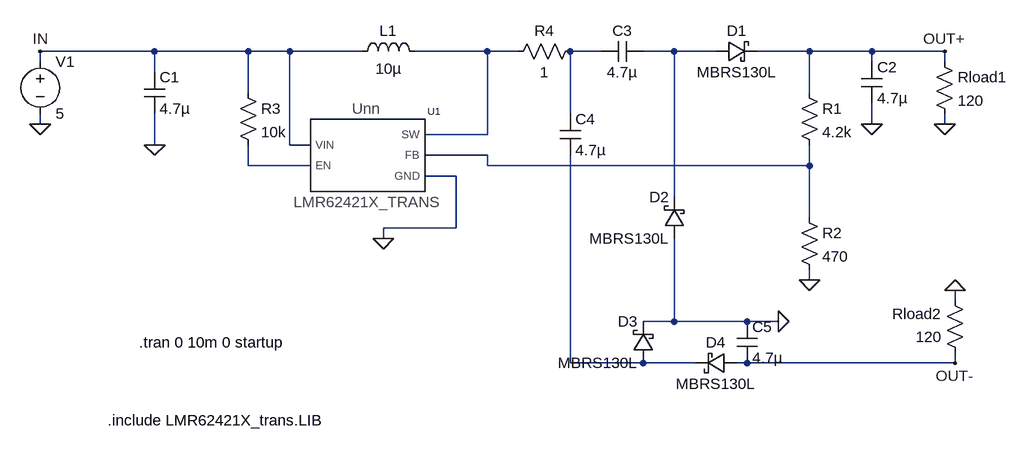
[diagram p0: schematic TI_LMR62421X_dual.asc]
TI_LMR62421X_dual.asc, the LTspice schematic file:
Version 4
SHEET 1 1960 1064
WIRE 240 480 64 480
WIRE 384 480 240 480
WIRE 448 480 384 480
WIRE 560 480 448 480
WIRE 752 480 640 480
WIRE 800 480 752 480
WIRE 928 480 880 480
WIRE 1040 480 992 480
WIRE 1104 480 1040 480
WIRE 1248 480 1168 480
WIRE 1344 480 1248 480
WIRE 1456 480 1344 480
WIRE 64 496 64 480
WIRE 1344 496 1344 480
WIRE 1456 496 1456 480
WIRE 240 512 240 480
WIRE 384 544 384 480
WIRE 1248 544 1248 480
WIRE 880 576 880 480
WIRE 64 592 64 576
WIRE 1344 592 1344 560
WIRE 1456 592 1456 576
WIRE 752 608 752 480
WIRE 752 608 656 608
WIRE 240 624 240 576
WIRE 448 624 448 480
WIRE 480 624 448 624
WIRE 752 640 656 640
WIRE 384 656 384 624
WIRE 480 656 384 656
WIRE 752 656 752 640
WIRE 1248 656 1248 624
WIRE 1248 656 752 656
WIRE 704 672 656 672
WIRE 1040 704 1040 480
WIRE 1248 736 1248 656
WIRE 704 752 704 672
WIRE 704 752 592 752
WIRE 592 768 592 752
WIRE 1248 832 1248 816
WIRE 1472 864 1472 848
WIRE 1040 896 1040 768
WIRE 1040 896 992 896
WIRE 1152 896 1040 896
WIRE 1200 896 1152 896
WIRE 880 960 880 640
WIRE 992 960 880 960
WIRE 1072 960 992 960
WIRE 1152 960 1136 960
WIRE 1472 960 1472 944
WIRE 1472 960 1152 960
FLAG 1456 480 OUT+
FLAG 1248 832 0
FLAG 1344 592 0
FLAG 1456 592 0
FLAG 592 768 0
FLAG 64 592 0
FLAG 64 480 IN
FLAG 240 624 0
FLAG 1200 896 0
FLAG 1472 960 OUT-
FLAG 1472 848 0
SYMBOL VOLTAGE 64 480 R0
WINDOW 123 0 0 Left 0
WINDOW 39 24 124 Left 2
SYMATTR InstName V1
SYMATTR Value 5
SYMBOL RES 1232 720 R0
SYMATTR InstName R2
SYMATTR Value 470
SYMBOL ind 544 496 R270
WINDOW 0 32 56 VTop 2
WINDOW 3 5 56 VBottom 2
SYMATTR InstName L1
SYMATTR Value 10µ
SYMBOL schottky 1104 496 R270
WINDOW 0 32 32 VTop 2
WINDOW 3 0 32 VBottom 2
SYMATTR InstName D1
SYMATTR Value MBRS130L
SYMBOL RES 1440 480 R0
SYMATTR InstName Rload1
SYMATTR Value 120
SYMBOL res 1232 528 R0
SYMATTR InstName R1
SYMATTR Value 4.2k
SYMBOL cap 864 576 R0
SYMATTR InstName C4
SYMATTR Value 4.7µ
SYMATTR SpiceLine Rser=1m
SYMBOL schottky 1056 768 R180
WINDOW 0 24 64 Left 2
WINDOW 3 24 0 Left 2
SYMATTR InstName D2
SYMATTR Value MBRS130L
SYMBOL schottky 1008 960 R180
WINDOW 0 24 64 Left 2
WINDOW 3 24 0 Left 2
SYMATTR InstName D3
SYMATTR Value MBRS130L
SYMBOL schottky 1136 944 R90
WINDOW 0 0 32 VBottom 2
WINDOW 3 32 32 VTop 2
SYMATTR InstName D4
SYMATTR Value MBRS130L
SYMBOL RES 1488 960 R180
WINDOW 0 36 76 Left 2
WINDOW 3 36 40 Left 2
SYMATTR InstName Rload2
SYMATTR Value 120
SYMBOL cap 1136 896 R0
SYMATTR InstName C5
SYMATTR Value 4.7µ
SYMATTR SpiceLine Rser=1m
SYMBOL cap 1328 496 R0
SYMATTR InstName C2
SYMATTR Value 4.7µ
SYMATTR SpiceLine Rser=1m
SYMBOL cap 224 512 R0
SYMATTR InstName C1
SYMATTR Value 4.7µ
SYMBOL cap 992 464 R90
WINDOW 0 0 32 VBottom 2
WINDOW 3 32 32 VTop 2
SYMATTR InstName C3
SYMATTR Value 4.7µ
SYMATTR SpiceLine Rser=1m
SYMBOL LMR62421X_TRANS 560 640 R0
SYMATTR InstName U1
SYMBOL res 368 528 R0
SYMATTR InstName R3
SYMATTR Value 10k
SYMBOL res 896 464 R90
WINDOW 0 0 56 VBottom 2
WINDOW 3 32 56 VTop 2
SYMATTR InstName R4
SYMATTR Value 1
TEXT 216 928 Left 2 !.tran 0 10m 0 startup
TEXT 168 1048 Left 2 !.include LMR62421X_trans.LIB

The netlist it stands for:
* TI_LMR62421X_dual.asc
V1 IN 0 5
R2 N004 0 470
L1 IN N001 10µ
D1 N003 OUT+ MBRS130L
Rload1 OUT+ 0 120
R1 OUT+ N004 4.2k
C4 N002 N006 4.7µ Rser=1m
D2 0 N003 MBRS130L
D3 N006 0 MBRS130L
D4 OUT- N006 MBRS130L
Rload2 OUT- 0 120
C5 0 OUT- 4.7µ Rser=1m
C2 OUT+ 0 4.7µ Rser=1m
C1 IN 0 4.7µ
C3 N003 N002 4.7µ Rser=1m
XU1 IN N005 N001 N004 0 LMR62421X_TRANS  ; pins VIN EN SW FB GND
R3 IN N005 10k
R4 N002 N001 1
.model D D
.lib standard.dio
.tran 0 10m 0 startup
.include LMR62421X_trans.LIB
.backanno
.end